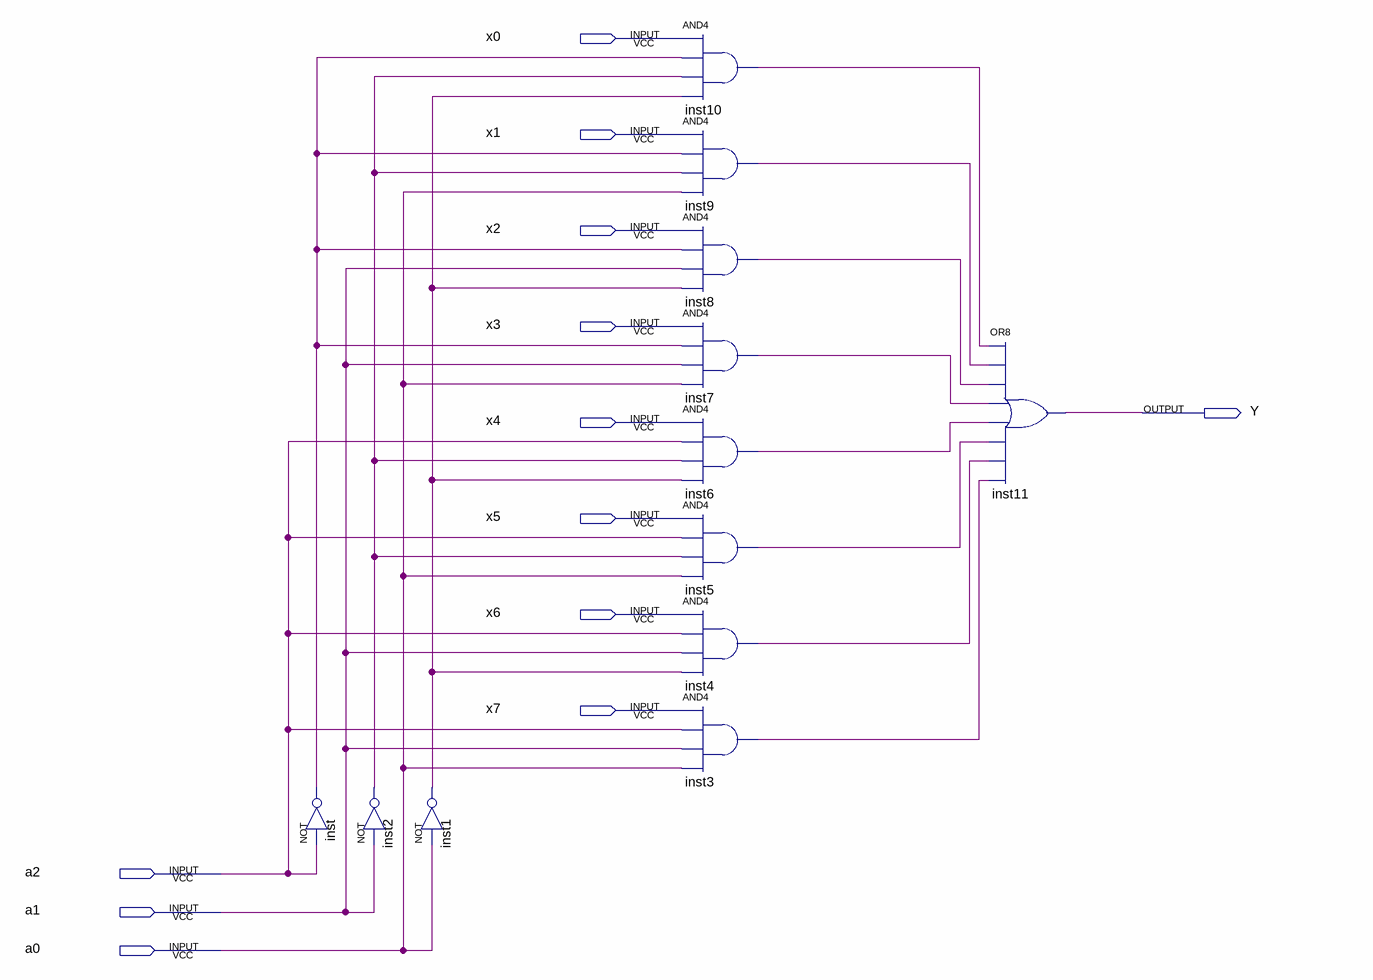
[diagram p0: schematic sheet]
// Quartus schematic Prac3.bdf as structural Verilog: 12 symbols, 12 pins
module Prac3 (
  input  x0,
  input  x1,
  input  x2,
  input  x3,
  input  x4,
  input  x5,
  input  x6,
  input  x7,
  input  a2,
  input  a1,
  input  a0,
  output Y
);

  wire inst1_out, inst2_out, inst3_out, inst4_out, inst5_out, inst6_out, inst7_out, inst8_out, inst9_out,
       inst10_out, inst_out;

  not inst (inst_out, a2);
  not inst1 (inst1_out, a0);
  not inst2 (inst2_out, a1);
  and inst10 (inst10_out, x0, inst_out, inst2_out, inst1_out);
  and inst9 (inst9_out, x1, inst_out, inst2_out, a0);
  and inst8 (inst8_out, x2, inst_out, a1, inst1_out);
  and inst7 (inst7_out, x3, inst_out, a1, a0);
  and inst6 (inst6_out, x4, a2, inst2_out, inst1_out);
  and inst5 (inst5_out, x5, a2, inst2_out, a0);
  and inst4 (inst4_out, x6, a2, a1, inst1_out);
  and inst3 (inst3_out, x7, a2, a1, a0);
  or inst11 (Y, inst10_out, inst9_out, inst8_out, inst7_out, inst6_out, inst5_out, inst4_out, inst3_out);
endmodule
